# EAGLE design OpenMind Shield (EAGLE 5.12)
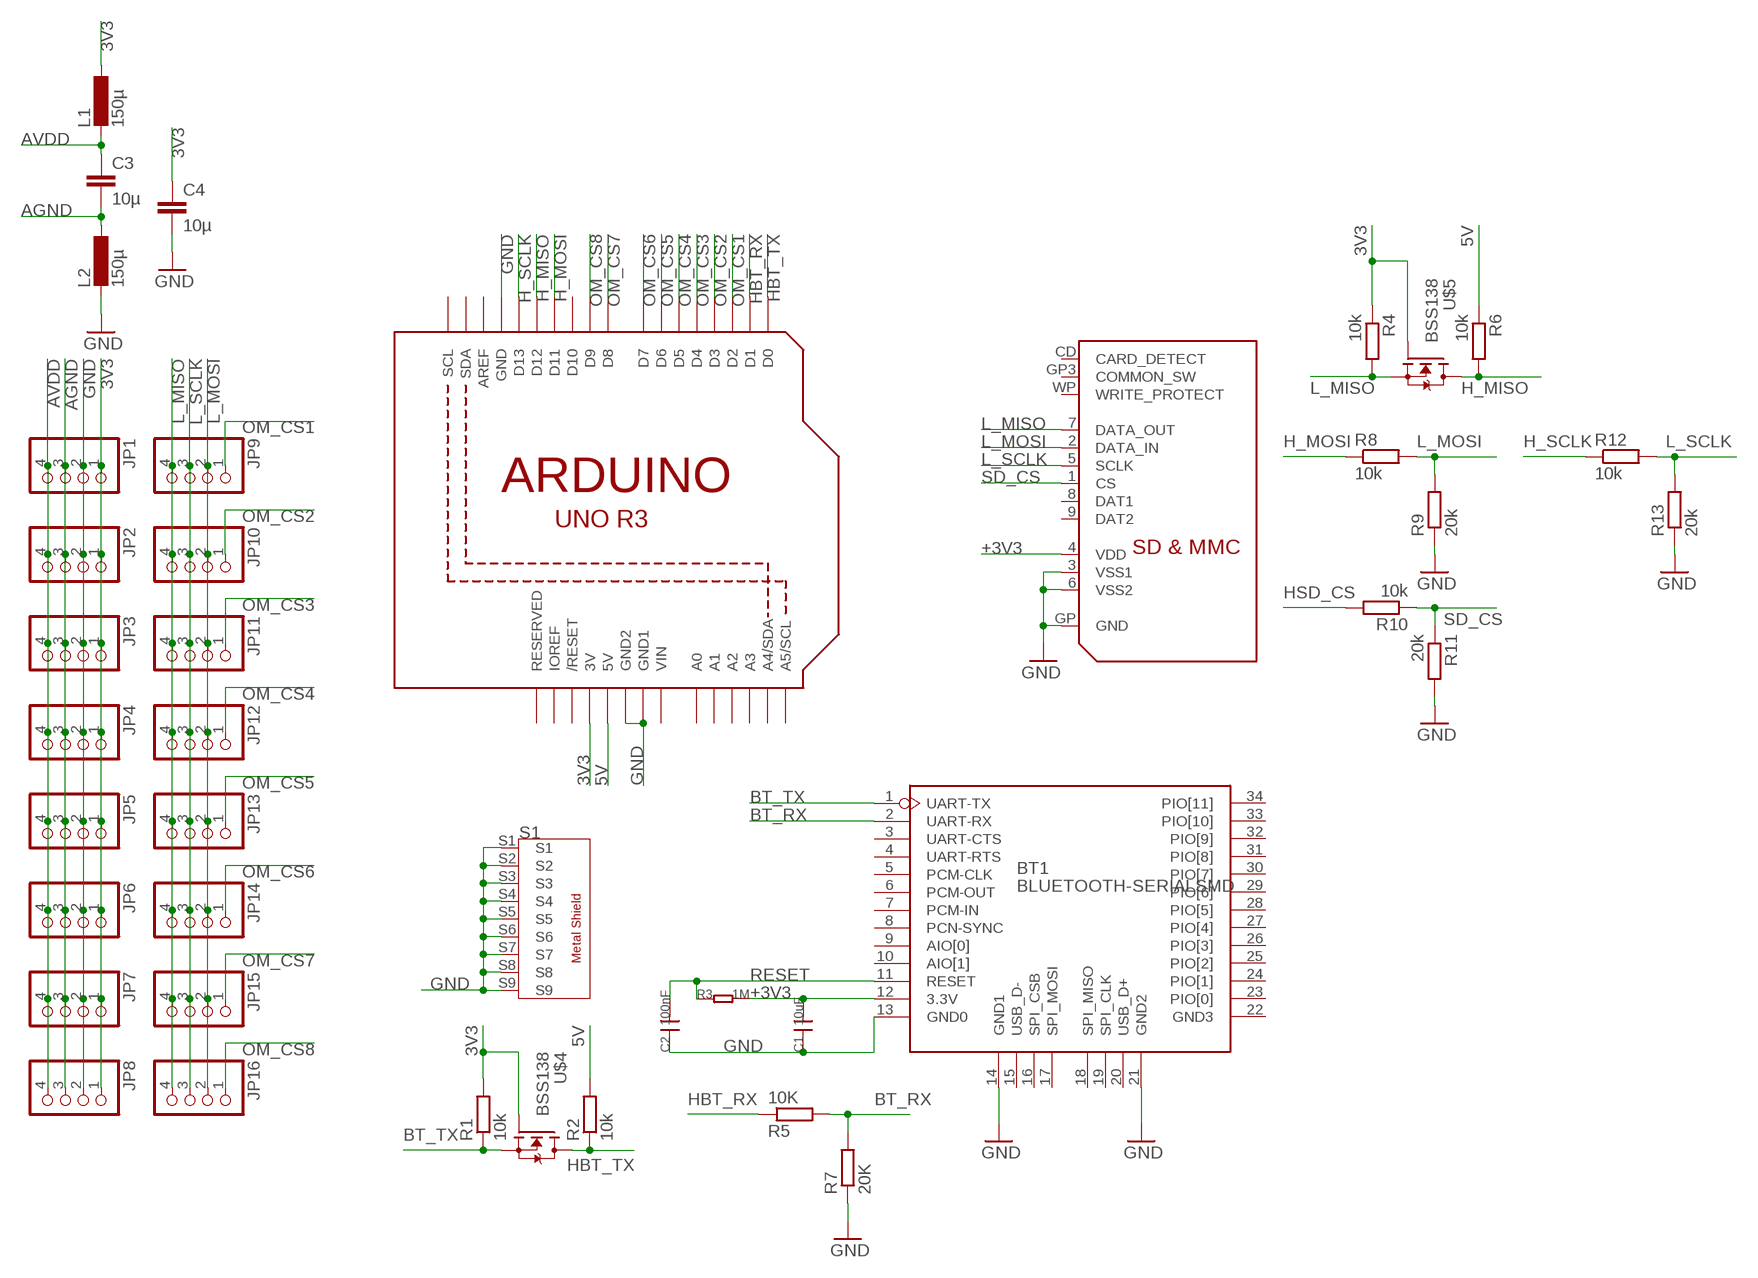
[diagram p0: schematic, sheet 1]

## Parts
BT1  BLUETOOTH-SERIALSMD  [SERIAL_BLUETEETH]
C1  10uF  C-0805  [0805]
C2  100nF  C-0603  [0603]
C3  10µ  C-EUC0805  [C0805]
C4  10µ  C-EUC0805  [C0805]
JP1  PINHD-1X4  [1X04]
JP2  PINHD-1X4  [1X04]
JP3  PINHD-1X4  [1X04]
JP4  PINHD-1X4  [1X04]
JP5  PINHD-1X4  [1X04]
JP6  PINHD-1X4  [1X04]
JP7  PINHD-1X4  [1X04]
JP8  PINHD-1X4  [1X04]
JP9  PINHD-1X4  [1X04]
JP10  PINHD-1X4  [1X04]
JP11  PINHD-1X4  [1X04]
JP12  PINHD-1X4  [1X04]
JP13  PINHD-1X4  [1X04]
JP14  PINHD-1X4  [1X04]
JP15  PINHD-1X4  [1X04]
JP16  PINHD-1X4  [1X04]
L1  150µ  L-EUPIS2816  [PIS2816]
L2  150µ  L-EUPIS2816  [PIS2816]
R1  10k  R-EU_M0805  [M0805]
R2  10k  R-EU_M0805  [M0805]
R3  1M  R-0603  [0603]
R4  10k  R-EU_M0805  [M0805]
R5  10K  R-EU_M0805  [M0805]
R6  10k  R-EU_M0805  [M0805]
R7  20K  R-EU_M0805  [M0805]
R8  10k  R-EU_M0805  [M0805]
R9  20k  R-EU_M0805  [M0805]
R10  10k  R-EU_M0805  [M0805]
R11  20k  R-EU_M0805  [M0805]
R12  10k  R-EU_M0805  [M0805]
R13  20k  R-EU_M0805  [M0805]
S1  EMI_SHIELD_BT  [BT_SHIELD]
U1  ARDUINOR3-DIMENSION  [ARDUINOR3]
U$3  SDMMC06132  [06132]
U$4  BSS138  [SOT23]
U$5  BSS138  [SOT23]

## Nets
3V3: C4.1 JP1.1 JP2.1 JP3.1 JP4.1 JP5.1 JP6.1 JP7.1 JP8.1 L1.1 R1.2 R4.1 U1.3V U$4.1(G) U$5.1(G)
5V: R2.2 R6.1 U1.5V
+3V3: BT1.12(3.3V) C1.2 R3.2 U$3.4(VDD)
AGND: C3.2 JP1.3 JP2.3 JP3.3 JP4.3 JP5.3 JP6.3 JP7.3 JP8.3 L2.1
AVDD: C3.1 JP1.4 JP2.4 JP3.4 JP4.4 JP5.4 JP6.4 JP7.4 JP8.4 L1.2
BT_RX: BT1.2(UART-RX) R5.2 R7.2
BT_TX: BT1.1(UART-TX) R1.1 U$4.2(S)
GND: BT1.13(GND0) BT1.14(GND1) BT1.21(GND2) C1.1 C2.1 C4.2 JP1.2 JP2.2 JP3.2 JP4.2 JP5.2 JP6.2 JP7.2 JP8.2 L2.2 R7.1 R9.1 R11.2 R13.1 S1.S1 S1.S2 S1.S3 S1.S4 S1.S5 S1.S6 S1.S7 S1.S8 S1.S9 U1.GND U1.GND1 U1.GND2 U$3.3(VSS1) U$3.6(VSS2) U$3.GP(GND)
H_MISO: R6.2 U1.D12 U$5.3(D)
H_MOSI: R8.1 U1.D11
H_SCLK: R12.1 U1.D13
HBT_RX: R5.1 U1.D1
HBT_TX: R2.1 U1.D0 U$4.3(D)
HSD_CS: R10.2
L_MISO: JP9.4 JP10.4 JP11.4 JP12.4 JP13.4 JP14.4 JP15.4 JP16.4 R4.2 U$3.7(DATA_OUT) U$5.2(S)
L_MOSI: JP9.2 JP10.2 JP11.2 JP12.2 JP13.2 JP14.2 JP15.2 JP16.2 R8.2 R9.2 U$3.2(DATA_IN)
L_SCLK: JP9.3 JP10.3 JP11.3 JP12.3 JP13.3 JP14.3 JP15.3 JP16.3 R12.2 R13.2 U$3.5(SCLK)
OM_CS1: JP9.1 U1.D2
OM_CS2: JP10.1 U1.D3
OM_CS3: JP11.1 U1.D4
OM_CS4: JP12.1 U1.D5
OM_CS5: JP13.1 U1.D6
OM_CS6: JP14.1 U1.D7
OM_CS7: JP15.1 U1.D8
OM_CS8: JP16.1 U1.D9
RESET: BT1.11(RESET) C2.2 R3.1
SD_CS: R10.1 R11.1 U$3.1(CS)
Unconnected: BT1.3(UART-CTS) BT1.4(UART-RTS) BT1.5(PCM-CLK) BT1.6(PCM-OUT) BT1.7(PCM-IN) BT1.8(PCN-SYNC) BT1.9(AIO[0]) BT1.10(AIO[1]) BT1.15(USB_D-) BT1.16(SPI_CSB) BT1.17(SPI_MOSI) BT1.18(SPI_MISO) BT1.19(SPI_CLK) BT1.20(USB_D+) BT1.22(GND3) BT1.23(PIO[0]) BT1.24(PIO[1]) BT1.25(PIO[2]) BT1.26(PIO[3]) BT1.27(PIO[4]) BT1.28(PIO[5]) BT1.29(PIO[6]) BT1.30(PIO[7]) BT1.31(PIO[8]) BT1.32(PIO[9]) BT1.33(PIO[10]) BT1.34(PIO[11]) U1.A0 U1.A1 U1.A2 U1.A3 U1.A4(A4/SDA) U1.A5(A5/SCL) U1.AREF U1.D10 U1.IOREF U1.RESERVED U1.RESET(/RESET) U1.SCL U1.SDA U$3.8(DAT1) U$3.9(DAT2) U$3.CD(CARD_DETECT) U$3.GP3(COMMON_SW) U$3.WP(WRITE_PROTECT)

## Power pins joined to a net without a drawn wire
VIN: U1.VIN

## Library data of the parts
BT1 = Module:BLUETOOTH-SERIAL
C1 C2 = Discrete:C*: Ceramic Capacitors
C3 C4 = rcl:C-EU: CAPACITOR, European symbol
JP1-JP16 = pinhead:PINHD-1X4: PIN HEADER
L1 L2 = rcl:L-EU: INDUCTOR, European symbol
R1 R2 R5 R7 = resistor:R-EU_: RESISTOR, European symbol
R3 = Discrete:R*
R4 R6 R8-R13 = rcl:R-EU_: RESISTOR, European symbol
S1 = Module:EMI_SHIELD
U1 = adafruit:ARDUINOR3: This is a new object for the new Arduino R3 - with extra pins that you may want to use (such as IOref, and duplicated A4/A5
U$3 = adafruit:SDMMC: SD MMC Card holder 4UCON part #06132 - easy to solder
U$4 U$5 = transistor-fet:BSS138

## Net classes
0 default: width 0.003 mm, drill 0.254 mm, clearance 0.152 mm

## Board
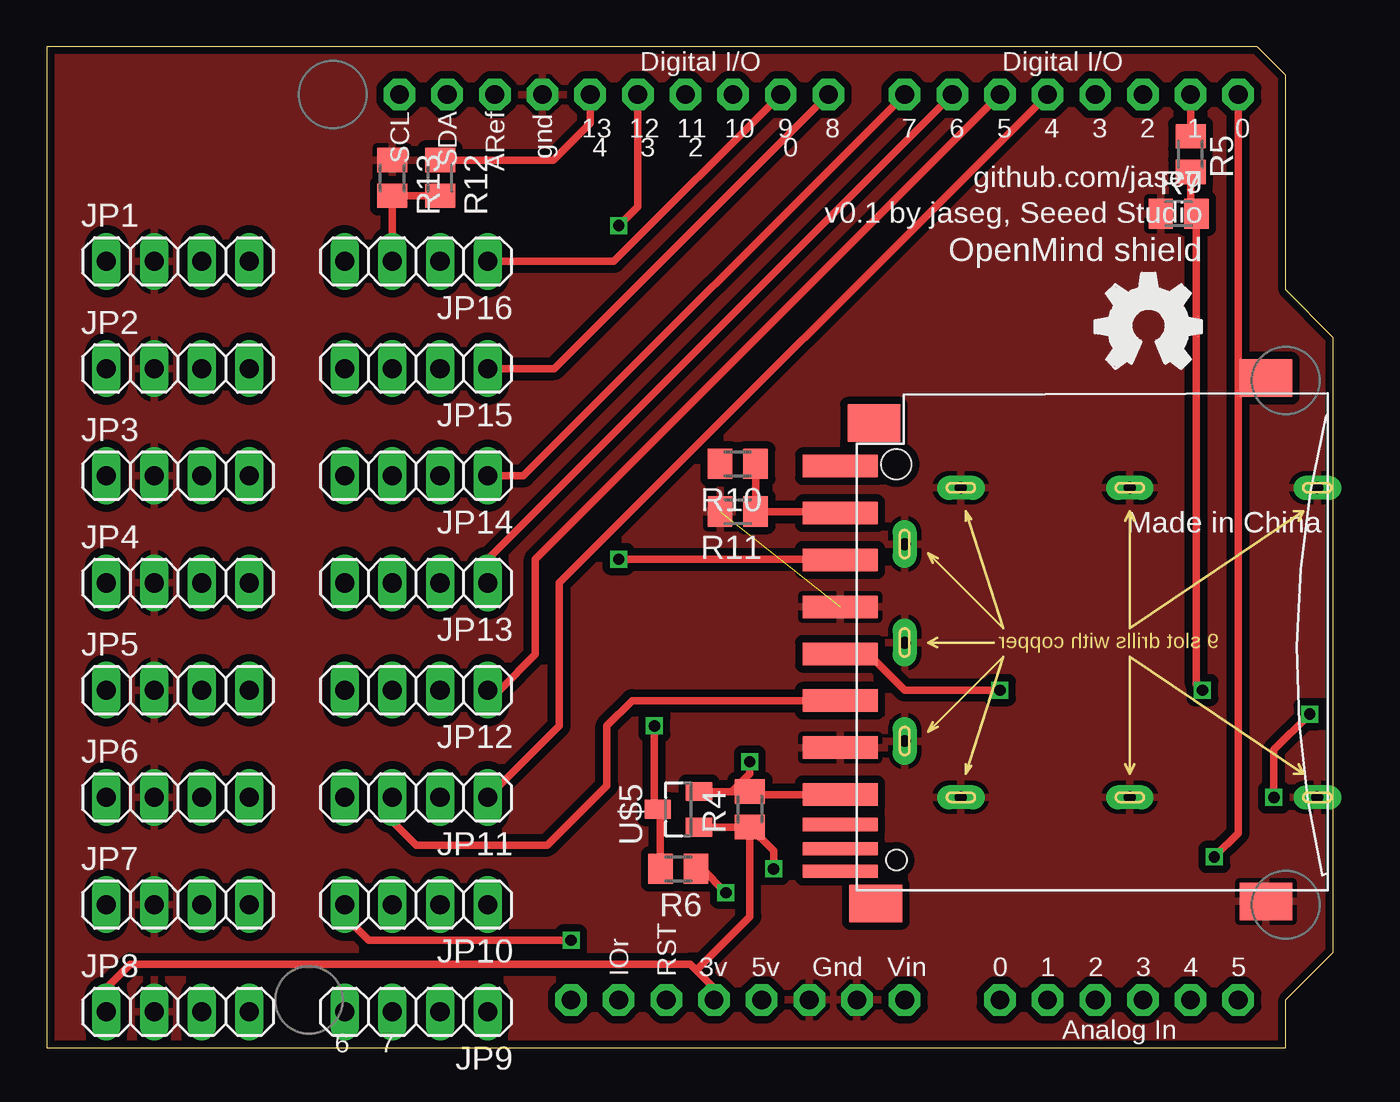
[diagram p1: board, top side]
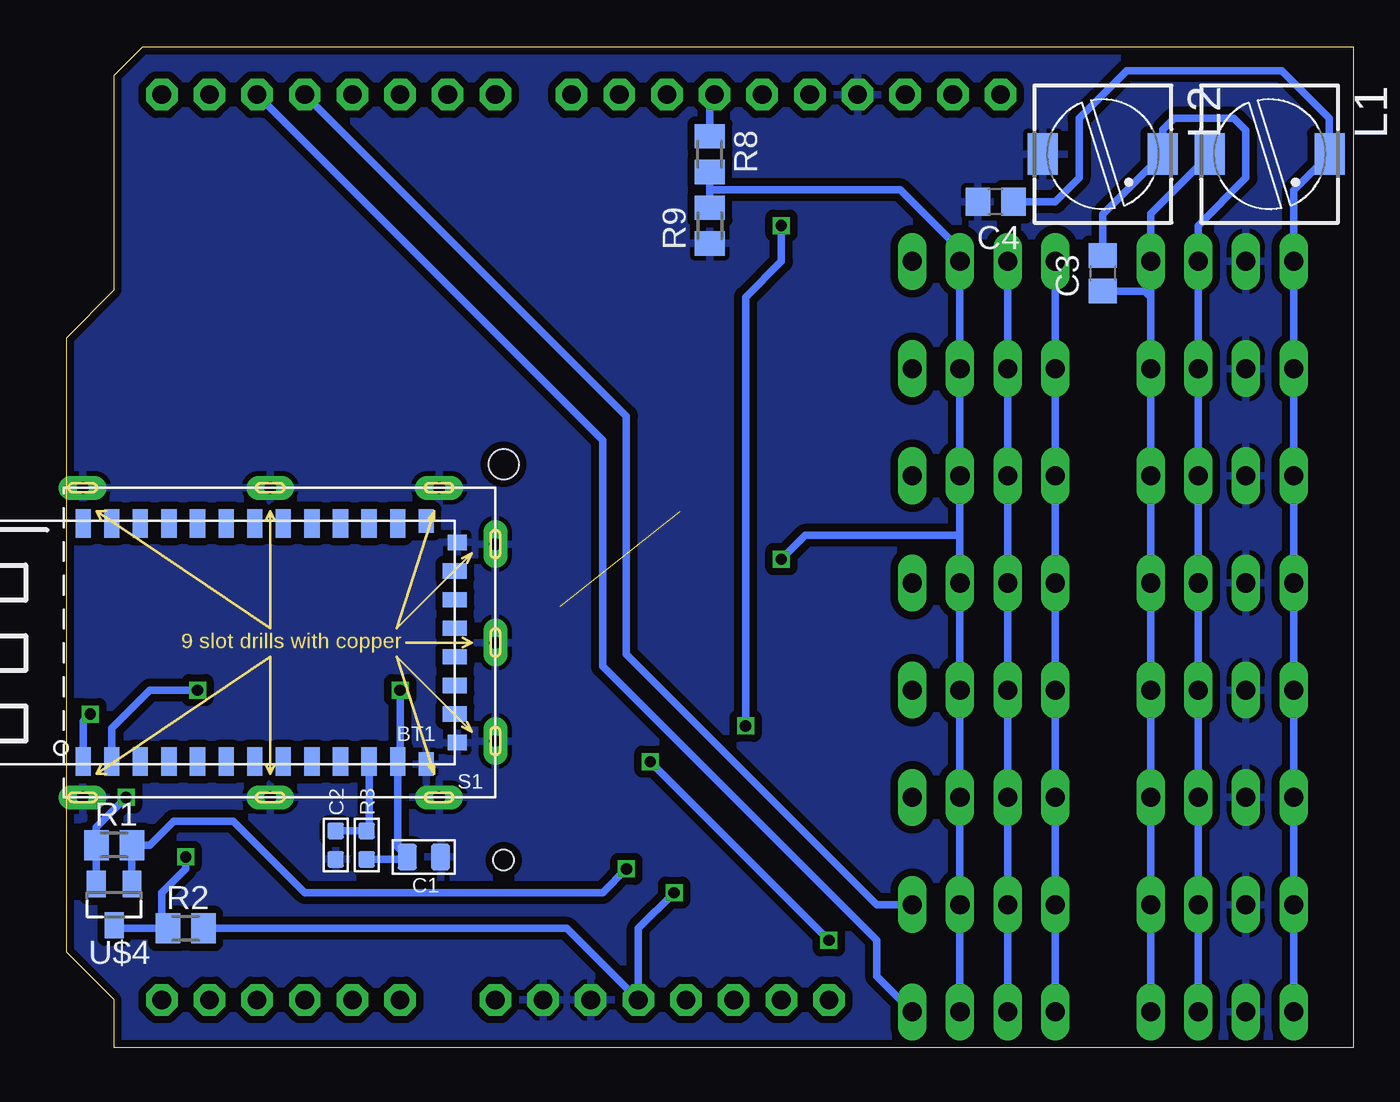
[diagram p2: board, bottom side, seen from below]

Size 68.58 x 53.34 mm. Coordinates in mm from the lower left corner, seen from the top.
Copper layers (1*16): Top 0.035mm / dielectric 1.5mm / Bottom 0.035mm
Design rules "SeeedStudio_rule_no_angle_090911": minimum track width 6mil, minimum drill 12mil, track to track 6mil, track to pad 6mil, pad to pad 6mil, via to via 6mil, smd to smd 0mil, copper to edge 10mil, drill to drill 10mil, minimum pad ring 10mil, minimum via ring 6mil, stop-mask expansion 2mil, vias tented up to drill 100mil, thermal gap 10mil

### Footprints (pad centres in the part's own frame; a part is rotated, then mirrored left to right if it is on the bottom)
SERIAL_BLUETEETH = smd 1.524 x 0.813: 1 -6.35,19.812; 2 -6.35,18.288; 3 -6.35,16.764; 4 -6.35,15.24; 5 -6.35,13.716; 6 -6.35,12.192; 7 -6.35,10.668; 8 -6.35,9.144; 9 -6.35,7.62; 10 -6.35,6.096; 11 -6.35,4.572; 12 -6.35,3.048; 23 6.35,3.048; 24 6.35,4.572; 25 6.35,6.096; 26 6.35,7.62; 27 6.35,9.144; 28 6.35,10.668; 29 6.35,12.192; 30 6.35,13.716; 31 6.35,15.24; 32 6.35,16.764; 33 6.35,18.288; 34 6.35,19.812 | smd 1.27 x 0.813: 13 -6.477,1.524; 22 6.477,1.524 | smd 0.813 x 1.016: 14 -5.334,-0.127; 21 5.334,-0.127 | smd 0.813 x 1.27: 15 -3.81,0; 16 -2.286,0; 17 -0.762,0; 18 0.762,0; 19 2.286,0; 20 3.81,0
0805 = smd 1.016 x 1.397: 1 -0.889,0; 2 0.889,0
0603 = smd 0.889 x 0.889: 1 -0.762,0; 2 0.762,0
C0805 = smd 1.3 x 1.5: 1 -0.95,0; 2 0.95,0
1X04 = drill 1.016 long: 1 -3.81,0; 2 -1.27,0; 3 1.27,0; 4 3.81,0
PIS2816 = smd 2.2 x 1.6: 1 0,3.2; 2 0,-3.2
M0805 = smd 1.3 x 1.6: 1 -0.95,0; 2 0.95,0
BT_SHIELD = drill 0.635 pad 1.27 long: S1 0,5.25; S2 0,0; S3 0,-5.25; S4 3,-8.25; S5 12,-8.25; S6 22,-8.25; S7 22,8.25; S8 12,8.25; S9 3,8.25
ARDUINOR3 = drill 1 pad 1.676 octagon: 3V 35.56,2.54; 5V 38.1,2.54; A0 50.8,2.54; A1 53.34,2.54; A2 55.88,2.54; A3 58.42,2.54; A4 60.96,2.54; A5 63.5,2.54; AREF 23.876,50.8; D0 63.5,50.8; D1 60.96,50.8; D2 58.42,50.8; D3 55.88,50.8; D4 53.34,50.8; D5 50.8,50.8; D6 48.26,50.8; D7 45.72,50.8; D8 41.656,50.8; D9 39.116,50.8; D10 36.576,50.8; D11 34.036,50.8; D12 31.496,50.8; D13 28.956,50.8; GND 26.416,50.8; GND1 43.18,2.54; GND2 40.64,2.54; IOREF 30.48,2.54; RESERVED 27.94,2.54; RESET 33.02,2.54; SCL 18.796,50.8; SDA 21.336,50.8; VIN 45.72,2.54
06132 = smd 1.2 x 4: 1 6.9,0.9; 2 4.4,0.9; 3 1.9,0.9; 4 -0.6,0.9; 5 -3.1,0.9; 6 -5.6,0.9; 7 -8.1,0.9; 9 9.4,0.9 | smd 0.7 x 4: 8 -9.7,0.9; CD -11,0.9; WP -12.2,0.9 | smd 2 x 2.8: GP -13.8,-21.8; GP2 14.1,-21.8; GP3 11.7,-0.9; GP4 -13.9,-1 | hole 1.1: -11.6,-2.1 | hole 1.6: 9.5,-2.1
SOT23 = smd 1 x 1.4: 1 -0.95,-1.1; 2 0.95,-1.1; 3 0,1.1

### Placement (x,y rotation side)
BT1  47.88,21.59 90 bottom
C1  49.53,10.16 180 bottom
C2  54.23,10.79 90 bottom
C3  13.34,41.27 90 bottom
C4  19.05,45.09 180 bottom
JP1  6.99,41.91 0 top
JP2  6.99,36.2 0 top
JP3  6.99,30.48 0 top
JP4  6.99,24.77 0 top
JP5  6.99,19.05 0 top
JP6  6.99,13.34 0 top
JP7  6.99,7.62 0 top
JP8  6.99,1.91 0 top
JP9  19.68,1.91 180 top
JP10  19.68,7.62 180 top
JP11  19.68,13.34 180 top
JP12  19.68,19.05 180 top
JP13  19.68,24.77 180 top
JP14  19.68,30.48 180 top
JP15  19.68,36.2 180 top
JP16  19.68,41.91 180 top
L1  4.45,47.62 270 bottom
L2  13.34,47.62 270 bottom
R1  66.04,10.79 0 bottom
R2  62.23,6.35 0 bottom
R3  52.58,10.79 270 bottom
R4  37.47,12.7 90 top
R5  60.96,47.62 270 top
R6  33.66,9.53 180 top
R7  60.33,44.45 0 top
R8  34.29,47.62 270 bottom
R9  34.29,43.81 90 bottom
R10  36.83,31.11 180 top
R11  36.83,28.57 180 top
R12  20.95,46.35 270 top
R13  18.41,46.35 270 top
S1  45.72,21.59 180 bottom
U1  0,0 0 top
U$1  [OSHW_FILLX200_NOTEXT]  55.88,36.2 0 top
U$3  43.18,21.59 90 top
U$4  66.04,7.62 180 bottom
U$5  33.66,12.7 90 top

### Tracks (layer width: path | path; a pad name or v marks a point on that pad's centre or on a via)
3V3  (via drill 0.6)
  Top 0.406: R4.1 U$5.1 | U1.3V 35.56,3.17 34.61,4.13 | 34.61,4.13 34.29,4.45 4.45,4.45 3.17,3.17 JP8.1 | R4.1 37.47,6.99 34.61,4.13 | R4.1 38.73,10.48 v38.73,9.53
  Bottom 0.406: JP8.1 JP7.1 JP6.1 JP5.1 JP4.1 JP3.1 JP2.1 JP1.1 3.17,45.7 L1.1 1.27,48.28 1.27,49.53 3.81,52.07 12.06,52.07 14.61,49.53 14.61,46.35 15.88,45.09 C4.1 | U$4.1 R1.2 64.14,10.79 62.87,12.06 59.69,12.06 55.88,8.26 40.01,8.26 v38.73,9.53
5V  (via drill 0.6)
  Top 0.406: v36.2,8.26 34.92,9.53 R6.1
  Bottom 0.406: R2.2 41.91,6.35 U1.5V 38.1,6.35 v36.2,8.26
+3V3  (via drill 0.6)
  Top 0.406: U$3.4 43.78,20.99 45.72,19.05 v50.8,19.05
  Bottom 0.406: R3.2 50.55,10.03 C1.2 50.93,10.67 BT1.12 50.8,15.37 v50.8,19.05
AGND
  Bottom 0.406: JP8.3 JP7.3 JP6.3 JP5.3 JP4.3 JP3.3 JP2.3 JP1.3 8.26,43.81 5.71,46.35 5.71,48.9 6.35,49.53 9.53,49.53 10.13,48.92 L2.1 13.34,44.42 C3.2
AVDD
  Bottom 0.406: JP8.4 JP7.4 JP6.4 JP5.4 JP4.4 JP3.4 JP2.4 10.79,40.01 | 10.79,40.01 JP1.4 10.79,44.45 7.64,47.6 L1.2 | C3.1 11.12,40.33 10.79,40.01
BT_RX  (via drill 0.6)
  Top 0.406: R5.2 60.96,44.77 R7.2 61.27,19.37 v61.59,19.05
  Bottom 0.406: v61.59,19.05 64.14,19.05 66.17,17.02 BT1.2
BT_TX  (via drill 0.6)
  Top 0.406: v65.41,13.34 65.41,15.88 v67.31,17.78
  Bottom 0.406: U$4.2 R1.1 66.99,11.75 v65.41,13.34 | v67.31,17.78 67.69,17.4 BT1.1
GND  (1 unrouted)
  pour Bottom (isolate 0.406): 0,53.34 68.58,53.34 68.58,0 0,0
  pour Top (isolate 0.406): 0,53.34 68.58,53.34 68.58,0 0,0
H_MISO  (via drill 0.6)
  Top 0.406: R6.2 32.7,12.55 U$5.3 32.38,12.87 v32.38,17.14 | v30.48,43.81 31.5,44.83 U1.D12
  Bottom 0.406: v32.38,17.14 32.38,40.01 30.48,41.91 v30.48,43.81
H_MOSI
  Bottom 0.406: U1.D11 34.29,50.55 R8.1
H_SCLK
  Top 0.406: U1.D13 28.96,49.28 26.98,47.3 R12.1
HBT_RX
  Top 0.406: R5.1 U1.D1
HBT_TX  (via drill 0.6)
  Top 0.406: U1.D0 63.5,11.43 v62.23,10.16
  Bottom 0.406: U$4.3 65.87,6.35 R2.1 63.5,6.67 63.5,8.26 62.23,9.53 v62.23,10.16
L_MISO  (via drill 0.6)
  Top 0.406: U$3.7 37.62,13.49 R4.2 U$5.2 36.51,13.65 37.47,14.61 v37.47,15.24 | v27.94,5.71 17.14,5.71 15.88,6.99 JP10.4
  Bottom 0.406: JP16.4 JP15.4 JP14.4 JP13.4 JP12.4 JP11.4 JP10.4 JP9.4 | v27.94,5.71 v37.47,15.24
L_MOSI  (via drill 0.6)
  Top 0.406: U$3.2 42.23,26.04 v30.48,26.04
  Bottom 0.406: 20.95,27.3 JP13.2 JP12.2 JP11.2 JP10.2 JP9.2 | 20.95,27.3 JP14.2 JP15.2 JP16.2 20.95,42.55 24.13,45.72 34.29,45.72 | 34.29,45.72 R9.2 | 34.29,45.72 R8.2 | v30.48,26.04 29.21,27.3 20.95,27.3
L_SCLK
  Top 0.406: R12.2 R13.2 JP16.3 | U$3.5 31.19,18.49 29.84,17.14 29.84,13.97 26.67,10.79 19.68,10.79 18.41,12.06 JP11.3
  Bottom 0.406: JP16.3 JP15.3 JP14.3 JP13.3 JP12.3 JP11.3 JP10.3 JP9.3
OM_CS1
  Bottom 0.406: U1.D2 40.01,32.38 40.01,20.32 25.4,5.71 25.4,3.81 JP9.1
OM_CS2
  Bottom 0.406: JP10.1 25.4,7.62 38.73,20.95 38.73,33.66 U1.D3
OM_CS3
  Top 0.406: U1.D4 27.3,24.77 27.3,17.14 JP11.1
OM_CS4
  Top 0.406: U1.D5 26.04,26.04 26.04,20.95 24.13,19.05 JP12.1
OM_CS5
  Top 0.406: U1.D6 23.5,26.04 JP13.1
OM_CS6
  Top 0.406: U1.D7 25.4,30.48 JP14.1
OM_CS7
  Top 0.406: U1.D8 27.05,36.2 JP15.1
OM_CS8
  Top 0.406: U1.D9 30.23,41.91 JP16.1
RESET
  Bottom 0.406: C2.2 R3.1 52.45,11.68 BT1.11
SD_CS
  Top 0.406: U$3.1 42.2,28.57 R11.1 R10.1

### Text on the board
tPlace: 4 | 3 | 2 | 0 | github.com/jaseg | v0.1 by jaseg, Seeed Studio | OpenMind shield | Made in China | 6 | 7